# Altium schematic sheet Control.SchDoc
size A4
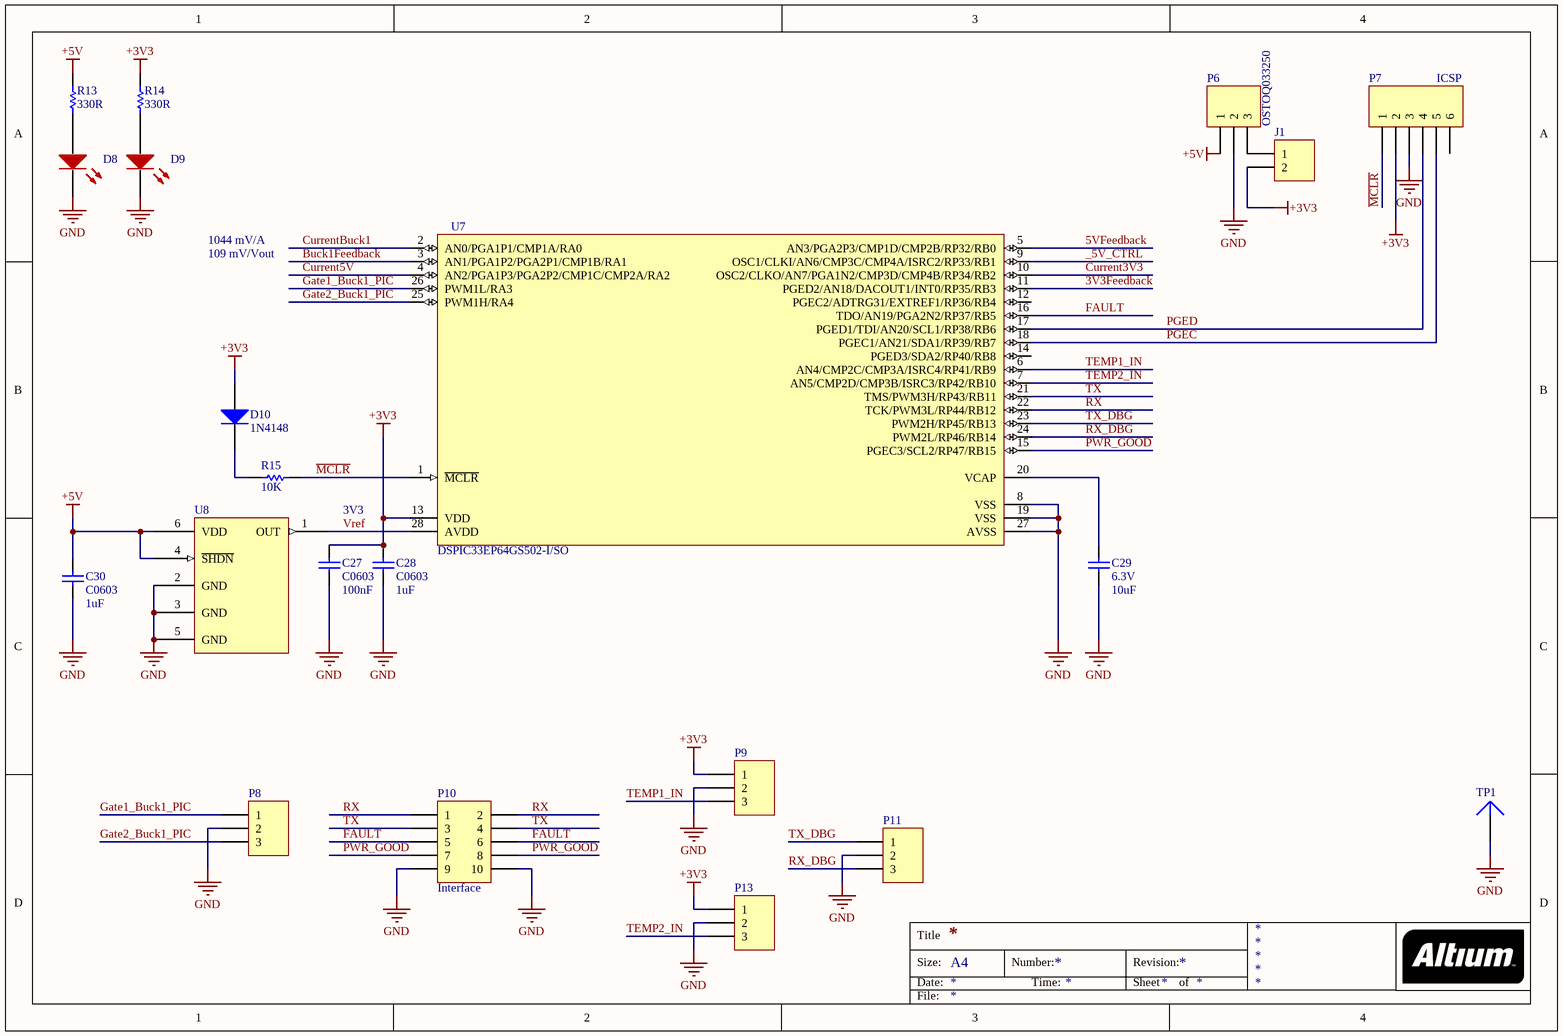
[diagram p0: Control.SchDoc]

## Parts
C27  C0603  value 100nF  [0603]
C28  C0603  value 1uF  [0603]
C29  6.3V  value 10uF  [C0805]
C30  C0603  value 1uF  [0603]
D8  15-21SURC/S530-A3/TR8  [15-21SURC/S530-A3/TR8]  (value not drawn)
D9  15-21SURC/S530-A3/TR8  [15-21SURC/S530-A3/TR8]  (value not drawn)
D10  1N4148  [SOD80C]
J1  Header 2  [My_1X02]  (value not drawn)
P6  XY2500R-F 3P  [OSTOQ033250]  (value not drawn)
P7  ICSP  [My_1X06]
P8  Header 3  [My_1X03]  (value not drawn)
P9  Header 3  [My_1X03]  (value not drawn)
P10  Interface  [HDR2X5]
P11  Header 3  [My_1X03]  (value not drawn)
P13  Header 3  [My_1X03]  (value not drawn)
R13  value 330R  [8RB-1206]  (hidden comment: SMD)
R14  value 330R  [8RB-1206]  (hidden comment: SMD)
R15  10K  [ERA-0603]
TP1  (no value)  [PIN1]
U7  Manufacturer Part Number: DSPIC33EP64GS502-I/SO  [MCHP-SOIC-SO28_N]  (hidden comment: DSPIC33EP64GS502)
U8  MCP1501T  [SOT-23-6]  (value not drawn)

## Nets
+3V3: C27.1 C28.1 D10.1(A) J1.2 P7.2 P9.1 P13.1 R14.1 U7.13(VDD)
+5V: C30.1 P6.1 R13.1 U8.4(~{SHDN}) U8.6(VDD)
GND: C27.2 C28.2 C29.1 C30.2 D8.2 D9.2 P6.2 P7.3 P8.2 P9.2 P10.9 P10.10 P11.2 P13.2 TP1.1 U7.8(VSS) U7.19(VSS) U7.27(AVSS) U8.2(GND) U8.3(GND) U8.5(GND)
3V3Feedback: U7.11(PGED2/AN18/DACOUT1/INT0/RP35/RB3)
5VFeedback: U7.5(AN3/PGA2P3/CMP1D/CMP2B/RP32/RB0)
_5V_CTRL: U7.9(OSC1/CLKI/AN6/CMP3C/CMP4A/ISRC2/RP33/RB1)
Buck1Feedback: U7.3(AN1/PGA1P2/PGA2P1/CMP1B/RA1)
Current3V3: U7.10(OSC2/CLKO/AN7/PGA1N2/CMP3D/CMP4B/RP34/RB2)
Current5V: U7.4(AN2/PGA1P3/PGA2P2/CMP1C/CMP2A/RA2)
CurrentBuck1: U7.2(AN0/PGA1P1/CMP1A/RA0)
FAULT: P10.5 P10.6 U7.16(TDO/AN19/PGA2N2/RP37/RB5)
Gate1_Buck1_PIC: P8.1 U7.26(PWM1L/RA3)
Gate2_Buck1_PIC: P8.3 U7.25(PWM1H/RA4)
~{MCLR}: P7.1 R15.1 U7.1(~{MCLR})
PGEC: P7.5 U7.18(PGEC1/AN21/SDA1/RP39/RB7)
PGED: P7.4 U7.17(PGED1/TDI/AN20/SCL1/RP38/RB6)
PWR_GOOD: P10.7 P10.8 U7.15(PGEC3/SCL2/RP47/RB15)
RX: P10.1 P10.2 U7.22(TCK/PWM3L/RP44/RB12)
RX_DBG: P11.3 U7.24(PWM2L/RP46/RB14)
TEMP1_IN: P9.3 U7.6(AN4/CMP2C/CMP3A/ISRC4/RP41/RB9)
TEMP2_IN: P13.3 U7.7(AN5/CMP2D/CMP3B/ISRC3/RP42/RB10)
TX: P10.3 P10.4 U7.21(TMS/PWM3H/RP43/RB11)
TX_DBG: P11.1 U7.23(PWM2H/RP45/RB13)
Vref: U7.28(AVDD) U8.1(OUT)
NetC29_2: C29.2 U7.20(VCAP)
NetD8_1: D8.1 R13.2
NetD9_1: D9.1 R14.2
NetD10_2: D10.2(K) R15.2
NetJ1_1: J1.1 P6.3

Not connected (* = marked no-connect by the designer): P7 6; U7 12(PGEC2/ADTRG31/EXTREF1/RP36/RB4) 14(PGED3/SDA2/RP40/RB8)

## Notes on the sheet
- 1044 mV/A
- 109 mV/Vout
- 3V3
- Title
- Size:
- Date:
- A4
- Number:
- Time:
- Revision:
- Sheet
- of
- File:

## Library data of the parts
C27 C28 C30 = C0603: C1608X7R1C105K X7R; Note: Footprint corresponds to dimensions for bulk cassette packaging. This case size has tightened tolerances.; Published: 17-Jul-2002; LatestRevisionDate: 19-Mar-2004; LatestRevisionNote: Silkscreen size reduced.; DatasheetDocument: Mar-2001; PackageDocument: Mar-2001; PackageReference: 0603; Publisher: Altium Limited; Code_JEITA: 0603; Code_IPC: 1608 [0603]; ComponentLink1Description: Manufacturer Link; ComponentLink1URL: http://www.kemet.com/; ComponentLink2Description: Datasheet; ComponentLink2URL: http://www.kemet.com/kemet/web/homepage/kechome.nsf/vapubfilesname/F3102TA.pdf/$file/F3102TA.pdf
C29 = CDR01: Ceramic Chip Capacitor - MIL-PRF-55681; Published: 17-Jul-2002; LatestRevisionDate: 19-Mar-2004; LatestRevisionNote: Silkscreen size reduced.; DatasheetDocument: Mar-2001; PackageDocument: Mar-2001; PackageReference: C0805; Publisher: Altium Limited; Code_JEITA: 0805; Code_IPC: 2012[0805]; ComponentLink1Description: Manufacturer Link; ComponentLink1URL: http://www.kemet.com/; ComponentLink2Description: Datasheet; ComponentLink2URL: http://www.kemet.com/kemet/web/homepage/kechome.nsf/vapubfilesname/F3102TA.pdf/$file/F3102TA.pdf
D8 D9 = 15-21SURC/S530-A3/TR8 led smd 0805 red
D10 = 1N4148: High Conductance Fast Diode; Published: 8-Jun-2000; LatestRevisionDate: 17-Jul-2002; LatestRevisionNote: Re-released for DXP Platform.; DatasheetDocument: 1997; PackageReference: DO-35; Publisher: Altium Limited; Code_JEDEC: DO-204-AH; ComponentLink1Description: Manufacturer Link; ComponentLink1URL: http://www.fairchildsemi.com/; ComponentLink2Description: Datasheet; ComponentLink2URL: http://www.fairchildsemi.com/ds/1N%2F1N4148.pdf
J1 = Header 2: Header, 2-Pin; LatestRevisionDate: 17-Jul-2002; LatestRevisionNote: Re-released for DXP Platform.; Publisher: Altium Limited
P6 = XY2500R-F 3P: HEADER 3P P/CI 90gra VERDE P=3.81MM XY2500R-F; Manufacturer: On Shore Technology Inc.; Material Flammability Rating: UL94 V-0; Voltage - UL: 300V; Current - UL: 10A; Pitch: 0.150" (3.81mm); Number of Levels: 1; Positions Per Level: 3; Header Orientation: Vertical; Contact Tail Length: 0.138" (3.50mm); Supplier 1: Digi-Key; Manufacturer Part Number: OSTOQ033250; Wire Strip Length: -; Termination Style: Solder; Mounting Type: Through Hole; Supplier: Digi-Key; Category: Connectors, Interconnects; Supplier Part Number: ED2820-ND; Voltage - IEC: -; Operating Temperature: -30°C ~ 105°C; Color: Green; Features: -; Ingress Protection: -; Wire Gauge or Range - mm²: -; Insulation Height: 0.362" (9.20mm); Wire Gauge or Range - AWG: -; Plug Wire Entry: -; Screw Size: -; Contact Mating Finish: Tin; Torque - Screw: -; Housing Material: Thermoplastic; Current - IEC: -; Contact Material: Brass; RoHS: RoHS Compliant; Part Status: Active; Packaging: Bulk; Type: Header, Male Pins, Shrouded (4 Side); Number of Positions: 3
P7 = Header 6: Header, 6-Pin; LatestRevisionDate: 17-Jul-2002; LatestRevisionNote: Re-released for DXP Platform.; Publisher: Altium Limited
P8 P9 P11 P13 = Header 3: Header, 3-Pin; LatestRevisionDate: 17-Jul-2002; LatestRevisionNote: Re-released for DXP Platform.; Publisher: Altium Limited
P10 = Header 5X2: Header, 5-Pin, Dual row; LatestRevisionDate: 17-Jul-2002; LatestRevisionNote: Re-released for DXP Platform.; Publisher: Altium Limited
R13 R14 = ERJ8BQ: Low Ohmic Value Thick Film Chip Resistor, 0.22 Ohm to 9.1 Ohm Range, 1%, 2% and 5% Tolerance, 1206 Size, 0.33 W; Published: 17-Dec-2003; LatestRevisionDate: 19-Mar-2004; LatestRevisionNote: Silkscreen size reduced.; PackageDocument: Mar-2003; PackageReference: 8RB-1206; Publisher: Altium Limited; Code_IPC: 3216 [1206]; ComponentLink1Description: Manufacturer Link; ComponentLink1URL: http://www.panasonic.com/industrial/components/resistive_products.htm; ComponentLink2Description: Datasheet; ComponentLink2URL: http://www.panasonic.com/industrial/components/pdf/AOA0000CE3.pdf
R15 = ERA3Y: Rectangular Thick Film Chip Resistor, 10 Ohm to 330k Ohm Range, 0.1% and 0.5% Tolerance, 0603 Size, 0.063 W; Note: If flow soldering, adjust pad width of PCB Footprint to 0.7 - 0.8 times the width of the resistor.; Published: 17-Dec-2003; LatestRevisionDate: 19-Mar-2004; LatestRevisionNote: Silkscreen size reduced.; PackageDocument: Mar-2003; PackageReference: ERA-0603; Publisher: Altium Limited; Code_IPC: 1608 [0603]; ComponentLink1Description: Manufacturer Link; ComponentLink1URL: http://www.panasonic.com/industrial/components/resistive_products.htm; ComponentLink2Description: Datasheet; ComponentLink2URL: http://www.panasonic.com/industrial/components/pdf/AOA0000CE8.pdf
TP1 = Plug: LatestRevisionDate: 17-Jul-2002; LatestRevisionNote: Re-released for DXP Platform.; Publisher: Altium Limited
U7 = DSPIC33EP64GS502: dsPIC dsPIC™ 33EP Microcontroller IC 16-Bit 70 MIPs 64KB (64K x 8) FLASH 28-SOIC; Manufacturer: Microchip Technology; Number of I/O: 21; Peripherals: Brown-out Detect/Reset, POR, PWM, WDT; Oscillator Type: Internal; Speed: 70 MIPs; Voltage - Supply (Vcc/Vdd): 3 V ~ 3.6 V; Data Converters: A/D 12x12b, D/A 1x12b; Connectivity: I²C, IrDA, LIN, SPI, UART/USART; RAM Size: 8K x 8; Package / Case: 28-SOIC (0.295", 7.50mm Width); Supplier Device Package: 28-SOIC; Program Memory Size: 64KB (64K x 8); Operating Temperature: -40°C ~ 85°C (TA); Core Processor: dsPIC; Category: Integrated Circuits (ICs); Program Memory Type: FLASH; Core Size: 16-Bit; Packaging: Tube; EEPROM Size: -; RoHS: RoHS Compliant; Part Status: Active; Supplier: Digi-Key; Supplier Part Number: DSPIC33EP64GS502-I/SO-ND
U8 = MCP1501T: Series Voltage Reference IC ±0.08% 20mA SOT-23-6